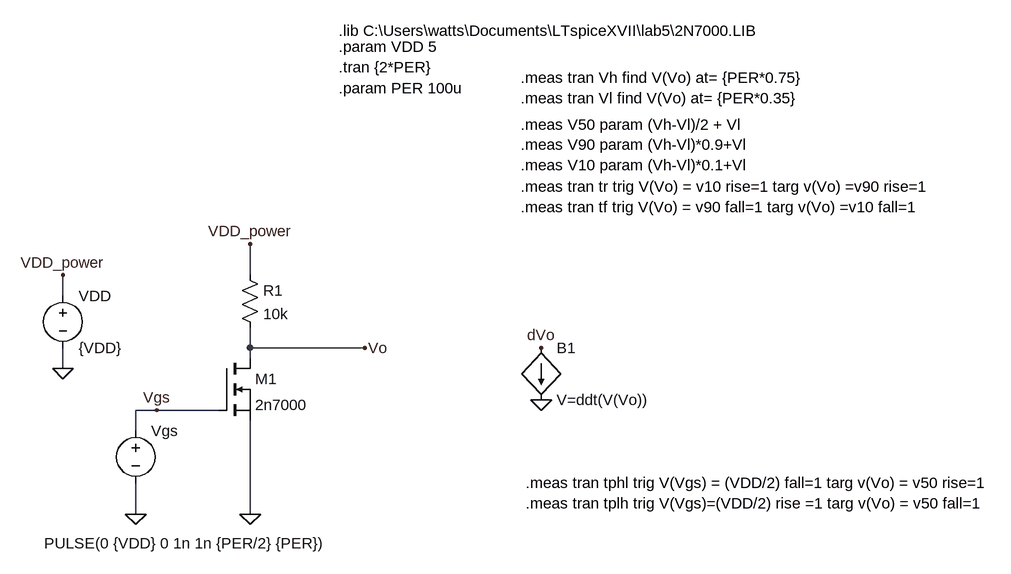
[diagram p0: schematic NMOS_2N700_measure.asc]
NMOS_2N700_measure.asc, the LTspice schematic file:
Version 4
SHEET 1 1476 680
WIRE 240 -16 240 -64
WIRE -48 16 -48 -16
WIRE 240 96 240 64
WIRE 416 96 240 96
WIRE 240 112 240 96
WIRE -48 128 -48 96
WIRE 96 192 64 192
WIRE 192 192 96 192
WIRE 64 224 64 192
WIRE 64 352 64 304
WIRE 240 352 240 208
FLAG 64 352 0
FLAG 240 352 0
FLAG -48 128 0
FLAG 240 -64 VDD_power
FLAG -48 -16 VDD_power
FLAG 688 176 0
FLAG 416 96 Vo
FLAG 688 96 dVo
FLAG 96 192 Vgs
SYMBOL nmos 192 112 R0
SYMATTR InstName M1
SYMATTR Value 2n7000
SYMATTR Prefix X
SYMBOL voltage 64 208 R0
WINDOW 3 -141 189 Left 2
WINDOW 123 0 0 Left 0
WINDOW 39 0 0 Left 0
SYMATTR InstName Vgs
SYMATTR Value PULSE(0 {VDD} 0 1n 1n {PER/2} {PER})
SYMBOL voltage -48 0 R0
WINDOW 123 0 0 Left 0
WINDOW 39 0 0 Left 0
SYMATTR InstName VDD
SYMATTR Value {VDD}
SYMBOL res 224 -32 R0
SYMATTR InstName R1
SYMATTR Value 10k
SYMBOL bi 688 96 R0
SYMATTR InstName B1
SYMATTR Value V=ddt(V(Vo))
TEXT 376 -392 Left 2 !.lib C:\\Users\\watts\\Documents\\LTspiceXVII\\lab5\\2N7000.LIB
TEXT 376 -368 Left 2 !.param VDD 5
TEXT 376 -336 Left 2 !.tran {2*PER}
TEXT 656 -152 Left 2 !.meas tran tr trig V(Vo) = v10 rise=1 targ v(Vo) =v90 rise=1\n.meas tran tf trig V(Vo) = v90 fall=1 targ v(Vo) =v10 fall=1
TEXT 376 -304 Left 2 !.param PER 100u
TEXT 656 -320 Left 2 !.meas tran Vh find V(Vo) at= {PER*0.75}\n.meas tran Vl find V(Vo) at= {PER*0.35}
TEXT 656 -248 Left 2 !.meas V50 param (Vh-Vl)/2 + Vl\n.meas V90 param (Vh-Vl)*0.9+Vl\n.meas V10 param (Vh-Vl)*0.1+Vl
TEXT 664 304 Left 2 !.meas tran tphl trig V(Vgs) = (VDD/2) fall=1 targ v(Vo) = v50 rise=1\n.meas tran tplh trig V(Vgs)=(VDD/2) rise =1 targ v(Vo) = v50 fall=1

The netlist it stands for:
* NMOS_2N700_measure.asc
XM1 Vo Vgs 0 2n7000  ; pins D G S
Vgs Vgs 0 PULSE(0 {VDD} 0 1n 1n {PER/2} {PER})
VDD VDD_power 0 {VDD}
R1 VDD_power Vo 10k
B1 dVo 0 V=ddt(V(Vo))
.lib C:\Users\watts\Documents\LTspiceXVII\lab5\2N7000.LIB
.param VDD 5
.tran {2*PER}
.meas tran tr trig V(Vo) = v10 rise=1 targ v(Vo) =v90 rise=1
.meas tran tf trig V(Vo) = v90 fall=1 targ v(Vo) =v10 fall=1
.param PER 100u
.meas tran Vh find V(Vo) at= {PER*0.75}
.meas tran Vl find V(Vo) at= {PER*0.35}
.meas V50 param (Vh-Vl)/2 + Vl
.meas V90 param (Vh-Vl)*0.9+Vl
.meas V10 param (Vh-Vl)*0.1+Vl
.meas tran tphl trig V(Vgs) = (VDD/2) fall=1 targ v(Vo) = v50 rise=1
.meas tran tplh trig V(Vgs)=(VDD/2) rise =1 targ v(Vo) = v50 fall=1
.backanno
.end